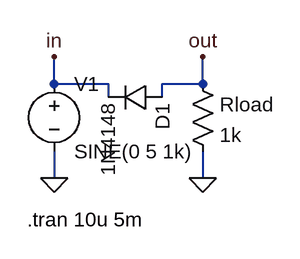
[diagram p0: schematic rectifier.asc]
rectifier.asc, the LTspice schematic file:
Version 4
SHEET 1 880 680
WIRE 128 80 192 80
WIRE 192 80 192 96
WIRE 256 96 256 80
WIRE 256 80 304 80
WIRE 128 80 128 48
WIRE 304 80 304 48
WIRE 128 160 128 192
WIRE 304 160 304 192
FLAG 128 48 in
FLAG 304 48 out
FLAG 128 192 0
FLAG 304 192 0
SYMBOL voltage 128 64 R0
SYMATTR InstName V1
SYMATTR Value SINE(0 5 1k)
SYMBOL diode 256 80 R90
SYMATTR InstName D1
SYMATTR Value 1N4148
SYMBOL res 288 64 R0
SYMATTR InstName Rload
SYMATTR Value 1k
TEXT 96 240 Left 2 !.tran 10u 5m

The netlist it stands for:
* rectifier.asc
V1 in 0 SINE(0 5 1k)
D1 out in 1N4148
Rload out 0 1k
.model D D
.lib standard.dio
.tran 10u 5m
.backanno
.end